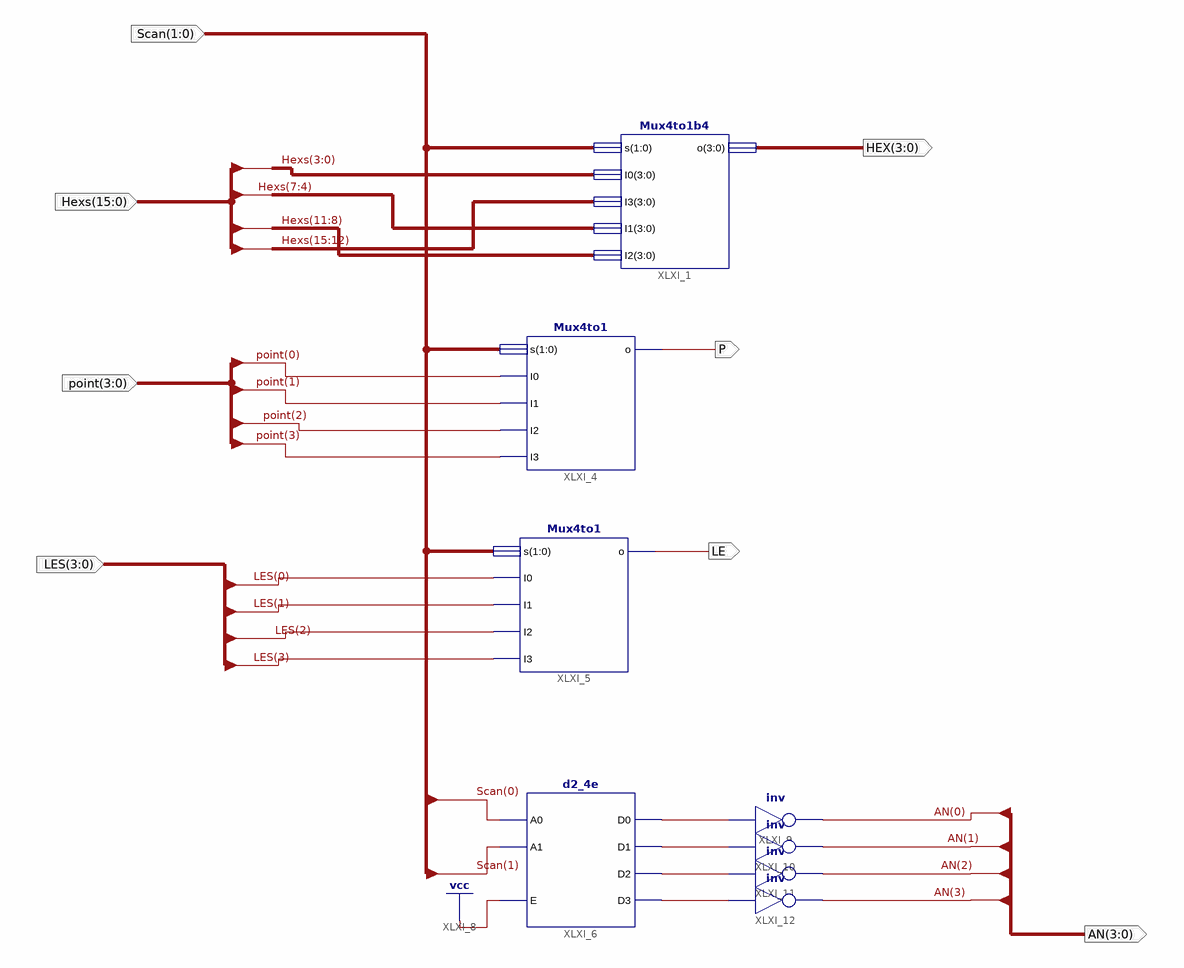
[diagram p0: schematic sheet 1]
// Xilinx ISE schematic DisplaySync.sch (kintex7) as structural Verilog: 8 symbols, 8 ports
module DisplaySync (
  input  [1:0] Scan,
  input  [15:0] Hexs,
  input  [3:0] point,
  input  [3:0] LES,
  output [3:0] HEX,
  output P,
  output LE,
  output [3:0] AN
);

  wire XLXN_49, XLXN_50, XLXN_51, XLXN_52;

  Mux4to1b4 XLXI_1 (.s(Scan), .I0(Hexs[3:0]), .I3(Hexs[15:12]), .I1(Hexs[7:4]), .I2(Hexs[11:8]), .o(HEX));
  Mux4to1 XLXI_4 (.s(Scan), .I0(point[0]), .I1(point[1]), .I2(point[2]), .I3(point[3]), .o(P));
  Mux4to1 XLXI_5 (.s(Scan), .I0(LES[0]), .I1(LES[1]), .I2(LES[2]), .I3(LES[3]), .o(LE));
  d2_4e XLXI_6 (.A0(Scan[0]), .A1(Scan[1]), .E(1'b1), .D0(XLXN_49), .D1(XLXN_50), .D2(XLXN_51), .D3(XLXN_52));
  not XLXI_9 (AN[0], XLXN_49);
  not XLXI_10 (AN[1], XLXN_50);
  not XLXI_11 (AN[2], XLXN_51);
  not XLXI_12 (AN[3], XLXN_52);
endmodule
